# EAGLE design irs-v8 (EAGLE 7.6.0)
CNAME: IRS sensor (RFM69HW); CREVISION: 1; DESIGNER: Dariusz Mazur
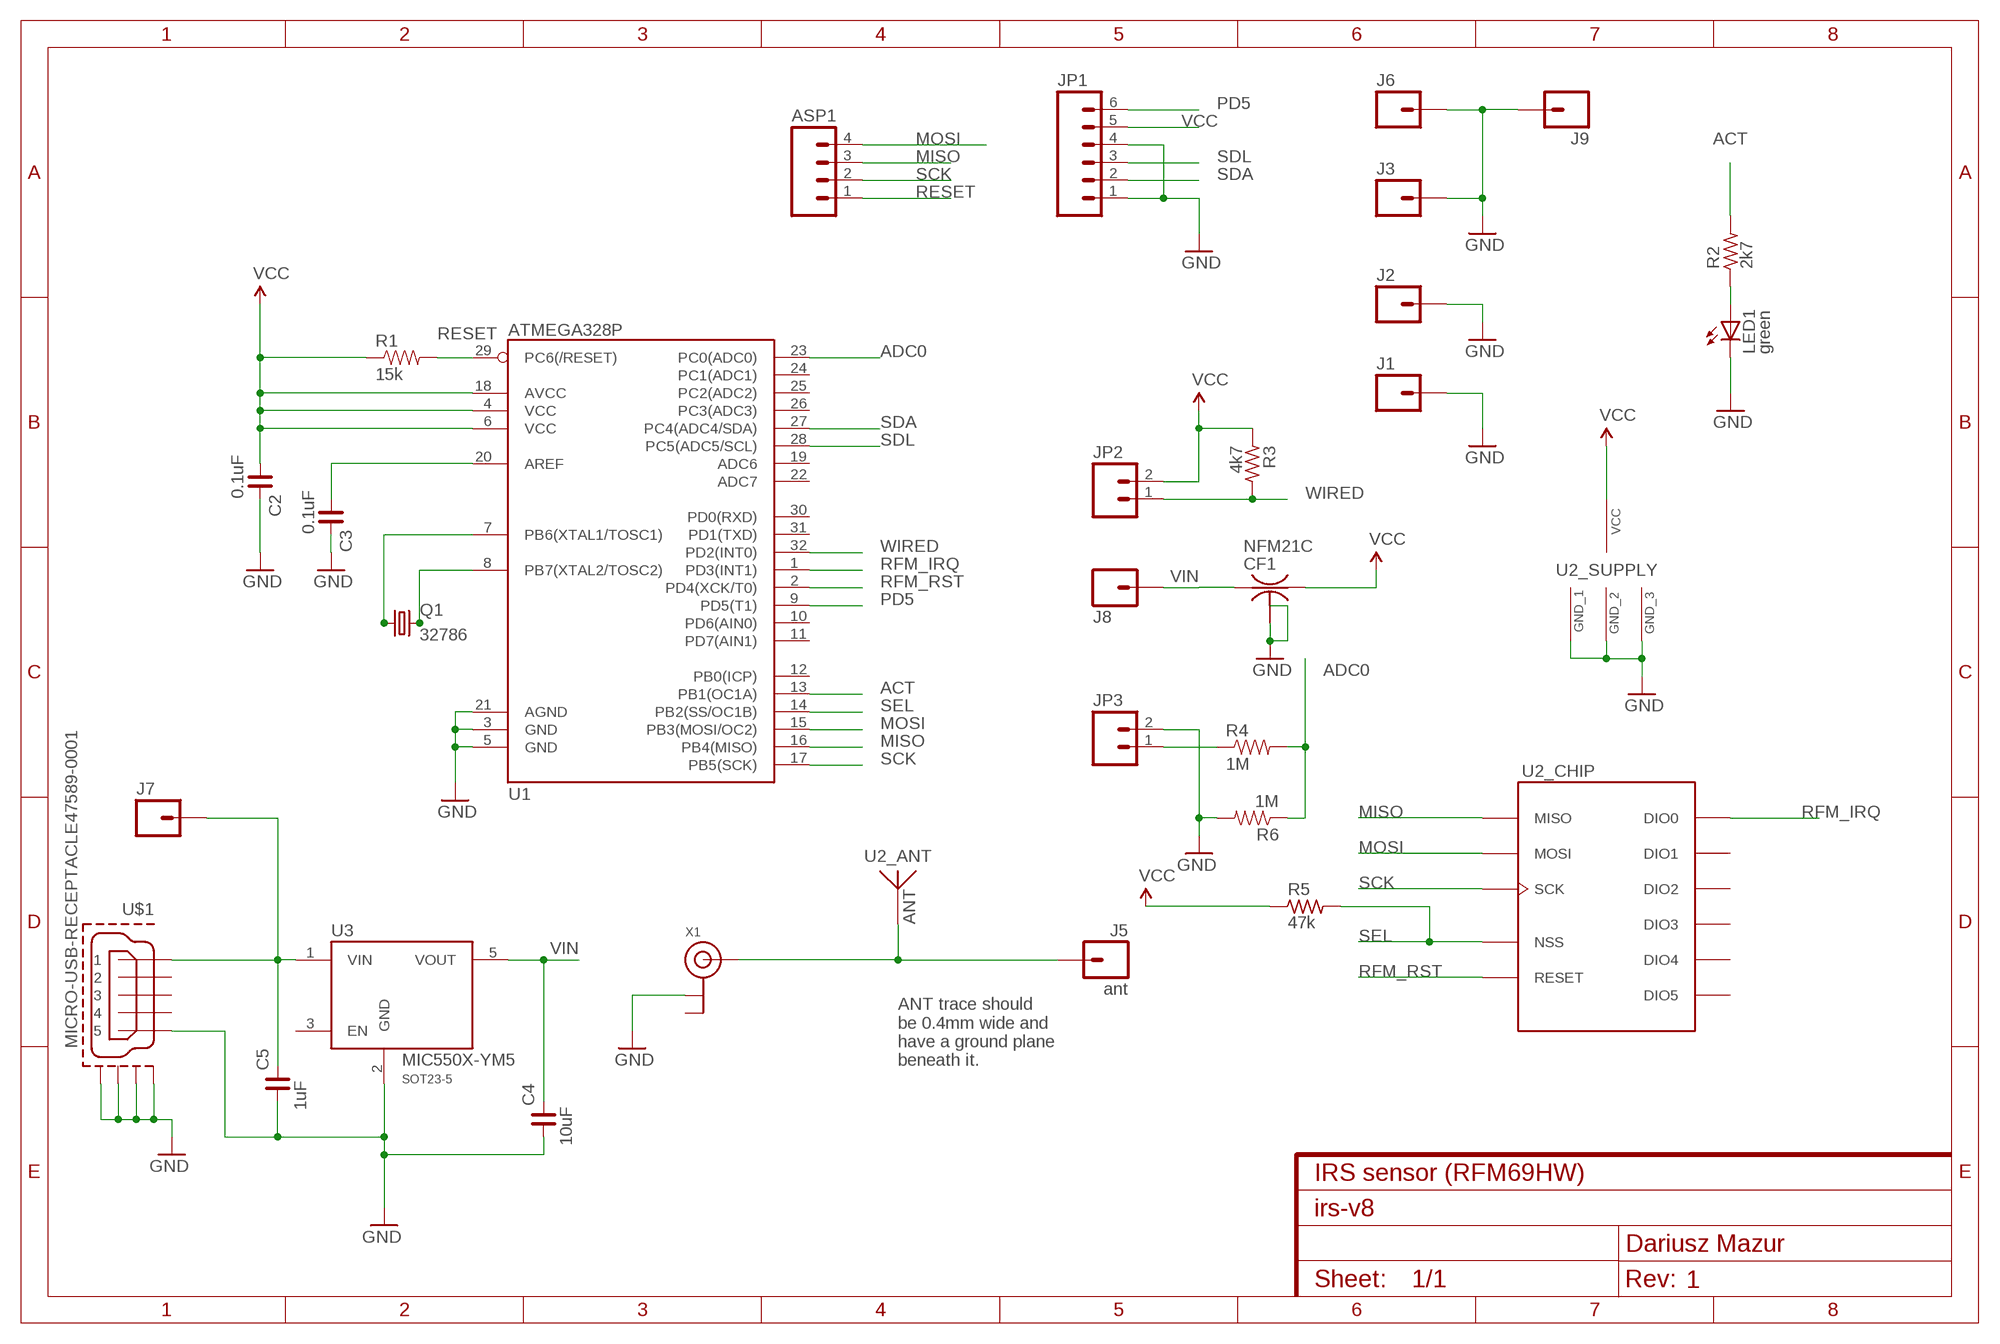
[diagram p0: schematic, sheet 1]

## Parts
ASP1  M04NO_SILK_ALL_ROUND  [1X04_NO_SILK_ALL_ROUND]
C2  0.1uF  C_0603  [C0603]
C3  0.1uF  C_0603  [C0603]
C4  10uF  C_0805  [C0805]
C5  1uF  C_0805  [C0805]
CF1  NFM21C  [NFM21C]
J1  M01PTH_NO_SILK_YES_STOP  [1X01_NO_SILK]
J2  M01PTH_NO_SILK_YES_STOP  [1X01_NO_SILK]
J3  M01PTH_NO_SILK_YES_STOP  [1X01_NO_SILK]
J5  ant  M01PTH_NO_SILK_YES_STOP  [1X01_NO_SILK]
J6  M01PTH_NO_SILK_YES_STOP  [1X01_NO_SILK]
J7  M01PTH_NO_SILK_YES_STOP  [1X01_NO_SILK]
J8  M01PTH_NO_SILK_YES_STOP  [1X01_NO_SILK]
J9  M01PTH_NO_SILK_YES_STOP  [1X01_NO_SILK]
JP1  M06NO_SILK_FEMALE_PTH  [1X06_NO_SILK]
JP2  M021X02_NO_SILK  [1X02_NO_SILK]
JP3  M021X02_NO_SILK  [1X02_NO_SILK]
LED1  green  LED0603  [LED-0603]
Q1  32786  MC-306  [MC-306]
R1  15k  RESISTOR0603-RES  [0603-RES]
R2  2k7  R_0603  [R0603]
R3  4k7  R_0603  [R0603]
R4  1M  RESISTOR0603-RES  [0603-RES]
R5  47k  R_0603  [R0603]
R6  1M  RESISTOR0603-RES  [0603-RES]
U1  ATMEGA328P  ATMEGA328_SMT  [TQFP32-08]
U2  RFM69HCW-S2  [HOPE-RF-16]
U3  MIC550X-YM5  [SOT23-5-DBV]
U$1  MICRO-USB-RECEPTACLE47589-0001  [47589-0001]
X1  ANTENNA_U.FL  [U.FL]

## Nets
ACT: R2.2 U1.13(PB1(OC1A))
ADC0: R4.2 R6.1 U1.23(PC0(ADC0))
GND: C2.2 C3.2 C4.1 C5.1 CF1.2@1 CF1.2@2 J1.1 J2.1 J3.1 J6.1 J9.1 JP1.1 JP1.4 JP3.2 LED1.C R6.2 U1.3(GND) U1.5(GND) U1.21(AGND) U2.GND1(_SUPPLY:GND_1) U2.GND2(_SUPPLY:GND_2) U2.GND3(_SUPPLY:GND_3) U3.2(GND) U$1.5 U$1.CASING1(GND1) U$1.CASING2(GND2) U$1.CASING3(GND3) U$1.CASING4(GND4) X1.1(GND)
MISO: ASP1.3 U1.16(PB4(MISO)) U2.MISO(_CHIP:MISO)
MOSI: ASP1.4 U1.15(PB3(MOSI/OC2)) U2.MOSI(_CHIP:MOSI)
N$1: LED1.A R2.1
N$2: JP3.1 R4.1
N$3: J5.1 U2.ANT(_ANT:ANT) X1.3(SIGNAL)
N$4: C3.1 U1.20(AREF)
N$5: Q1.1 U1.7(PB6(XTAL1/TOSC1))
N$6: Q1.4 U1.8(PB7(XTAL2/TOSC2))
N$13: C5.2 J7.1 U3.1(VIN) U$1.1
PD5: JP1.6 U1.9(PD5(T1))
RESET: ASP1.1 R1.2 U1.29(PC6(/RESET))
RFM_IRQ: U1.1(PD3(INT1)) U2.DIO0(_CHIP:DIO0)
RFM_RST: U1.2(PD4(XCK/T0)) U2.RESET(_CHIP:RESET)
SCK: ASP1.2 U1.17(PB5(SCK)) U2.SCK(_CHIP:SCK)
SDA: JP1.2 U1.27(PC4(ADC4/SDA))
SDL: JP1.3 U1.28(PC5(ADC5/SCL))
SEL: R5.2 U1.14(PB2(SS/OC1B)) U2.NSS(_CHIP:NSS)
VCC: C2.1 CF1.3 JP1.5 JP2.2 R1.1 R3.1 R5.1 U1.4(VCC) U1.6(VCC) U1.18(AVCC) U2.3.3V(_SUPPLY:VCC)
VIN: C4.2 CF1.1 J8.1 U3.5(VOUT)
WIRED: JP2.1 R3.2 U1.32(PD2(INT0))
Unconnected: U1.10(PD6(AIN0)) U1.11(PD7(AIN1)) U1.12(PB0(ICP)) U1.19(ADC6) U1.22(ADC7) U1.24(PC1(ADC1)) U1.25(PC2(ADC2)) U1.26(PC3(ADC3)) U1.30(PD0(RXD)) U1.31(PD1(TXD)) U2.DIO1(_CHIP:DIO1) U2.DIO2(_CHIP:DIO2) U2.DIO3(_CHIP:DIO3) U2.DIO4(_CHIP:DIO4) U2.DIO5(_CHIP:DIO5) U3.3(EN) U$1.2 U$1.3 U$1.4 X1.2(GND)

## Notes on the sheet
- ANT trace should
  be 0.4mm wide and
  have a ground plane
  beneath it.

## Library data of the parts
ASP1 = SparkFun-Connectors:M04: Header 4 Standard 4-pin 0.1" header. Use with straight break away headers (SKU : PRT-00116), right angle break away headers (PRT-00553), swiss pins (PRT-00743), machine pins (PRT-00117), and female headers (PRT-00115). Molex polarized connector foot print use with SKU : PRT-08231 with associated crimp pins and housings. 1MM SMD Version SKU: PRT-10208; PROD_ID: CONN-09696
C2-C5 = rc-master-smd:C_: NON-POLARIZED CAP
CF1 = murata-filter:NFM: EMIFIL(R) (Capacitor type) Single Circuit Type for Signal Lines Source: http://search.murata.co.jp/Ceramy/image/img/PDF/ENG/L0111S0109NFM3DC.pdf; MPN: NFM21CC102R1H3D; OC_FARNELL: 1828795; OC_NEWARK: 84R0165
J1-J3 J5-J9 = SparkFun-Connectors:M01: Header 1 Standard 1-pin 0.1" header. Use with straight break away headers (SKU : PRT-00116), right angle break away headers (PRT-00553), swiss pins (PRT-00743), machine pins (PRT-00117), and female headers (PRT-00115). SMTSO-256-ET is a "flush mount" nut for a 4-40 screw. The older package used to be too tight, and did not allow it to sit properly thru the drill hit. The latest (0.165DIA) fits nice and snug.
JP1 = SparkFun-Connectors:M06: Header 6 Standard 6-pin 0.1" header. Use with straight break away headers (SKU : PRT-00116), right angle break away headers (PRT-00553), swiss pins (PRT-00743), machine pins (PRT-00117), and female headers (PRT-00115). Molex polarized connector foot print use with SKU : PRT-08094 with associated crimp pins and housings. NOTES ON THE VARIANTS LOCK and LOCK_LONGPADS... This footprint was designed to help hold the alignment of a through-hole component (i.e. 6-pin header) while soldering it into place. You may notice that each hole has been shifted either up or down by 0.005 of an inch from it's more standard position (which is a perfectly straight line). This slight alteration caused the pins (the squares in the middle) to touch the edges of the holes. Because they are alternating, it causes a "brace" to hold the component in place. 0.005 has proven to be the perfect amount of "off-center" position when using our standard breakaway headers. Although looks a little odd when you look at the bare footprint, once you have a header in there, the alteration is very hard to notice. Also,if you push a header all the way into place, it is covered up entirely on the bottom side. This idea of altering the position of holes to aid alignment will be further integrated into the Sparkfun Library for other footprints. It can help hold any component with 3 or more connection pins.; PROD_ID: CONN-08437
JP2 JP3 = SparkFun-Connectors:M02: Standard 2-pin 0.1" header. Use with - straight break away headers ( PRT-00116) - right angle break away headers (PRT-00553) - swiss pins (PRT-00743) - machine pins (PRT-00117) - female headers (PRT-00115) Molex polarized connector foot print use with: PRT-08233 with associated crimp pins and housings. 2.54_SCREWTERM for use with PRT-10571. 3.5mm Screw Terminal footprints for PRT-08084 5mm Screw Terminal footprints for use with PRT-08432
LED1 = SparkFun-LED:LED: LEDs Standard schematic elements and footprints for 5mm, 3mm, 1206, and 0603 sized LEDs. 5mm - Spark Fun Electronics SKU : COM-00529 (and others)
Q1 = crystal:MC-306: kHz RANGE CRYSTAL UNIT SMD Source: MC-306_405_406_E07X.PDF Homepage <http://www.epsontoyocom.co.jp>; MPN: MC-306 60.0KHZ 100PPM ,12.5PF; OC_FARNELL: 1278040; OC_NEWARK: 31M5576
R1 R4 R6 = SparkFun-Passives:RESISTOR: Resistor Basic schematic elements and footprints for 0603, 1206, and PTH resistors.
R2 R3 R5 = rc-master-smd:R_: RESISTOR
U1 = SparkFun-DigitalIC:ATMEGA328_SMT: 32-Pin Atmega328 part Commonly used on Arduino compatible boards Available in QFP and QFN packages TQFP is IC-09069 QFN is non-stock; PROD_ID: IC-09069
U2 = icmi-custom-parts:RFM69HCW: HopeRF RFM69HCW ISM Transceiver Module The RFM69HCW <http://www.hoperf.com/rf/fsk_module/RFM69HCW.htm> is a transceiver module capable of operation over a wide frequency range, including the 315,433,868 and 915MHz license-free ISM (Industry Scientific and Medical) frequency bands. All major RF communication parameters are programmable and most of them can be dynamically set. The RFM69HCW offers the unique advantage of programmable narrow-band and wide- band communication modes. The RFM69HCW is optimized for low power consumption while offering high RF output power and channelized operation. Compliance ETSI and FCC regulations. In order to better use RFM69HCW modules, this specification also involves a large number of the parameters and functions of its core chip RF69H's,including those IC pins which are not leaded out. All of these can help customers gain a better understanding of the performance of RFM69HCW modules, and enhance the application skills.
U3 = borkedlabs-powerics:MIC550X; PACKAGE: SOT23-5
U$1 = con-molex-usb:MICRO-USB-RECEPTACLE: MICRO USB RECEPTACLES Micro-USB Receptacles, SMT, Lead-Free from MOLEX <http://www.molex.com/>. (C) 2014 Tomasz Boleslaw CEDRO, cederom@tlen.pl, http://www.tomek.cedro.info. Version 0.1 (2014-01-17): Initial release. Version 0.2 (2014-02-06): Updated 47589-0001 footprint pins/pads/milling. Following devices are included: 1. 47589-0001 Micro-USB AB Receptacle, Bottom Mount, SMT, Lead-Free <http://www.molex.com/molex/products/datasheet.jsp?part=active/0475890001_IO_CONNECTORS.xml> (Technical Drawing <http://www.molex.com/pdm_docs/sd/475890001_sd.pdf>).
X1 = adafruit:ANTENNA_U.FL: U.FL Antenna Connector

## Board
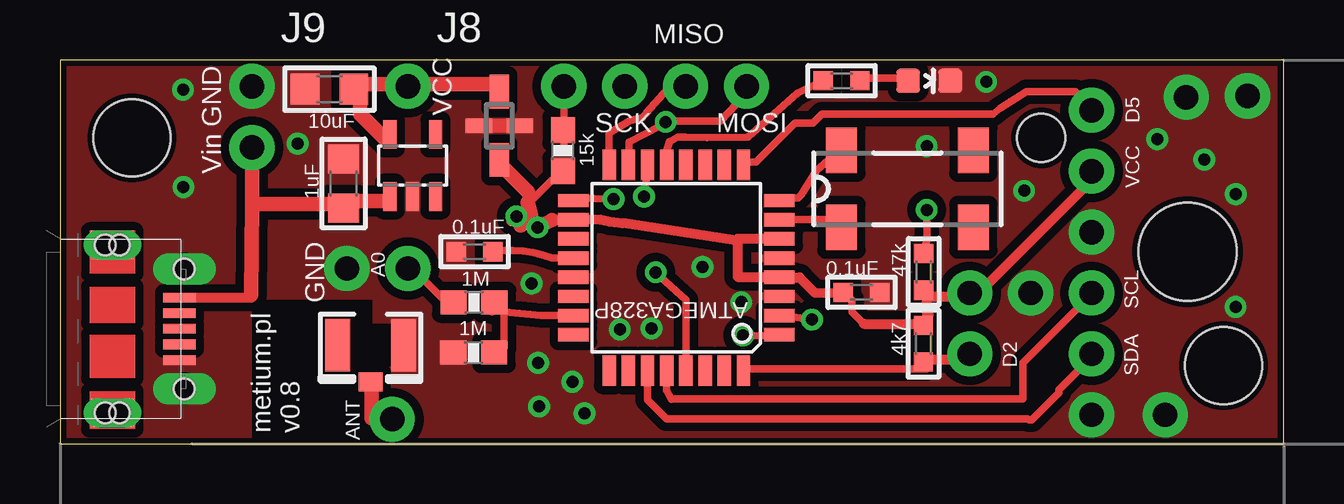
[diagram p1: board, top side]
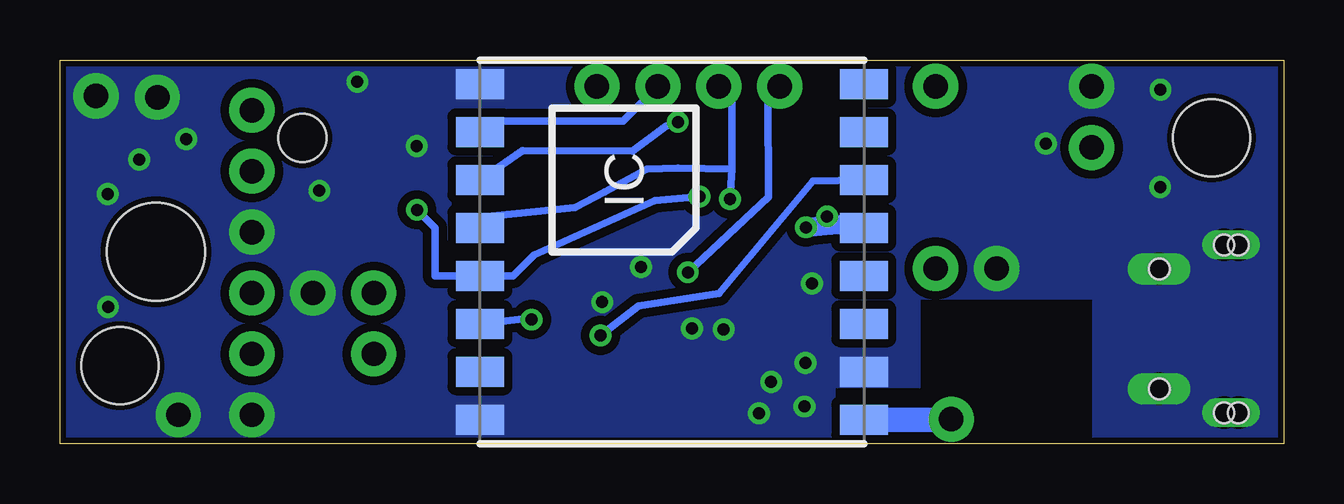
[diagram p2: board, bottom side, seen from below]

Size 51 x 16 mm. Coordinates in mm from the lower left corner, seen from the top.
Outline: 0,0 51,0 51,16 0,16 0,0
Copper layers (1*16): Top 0.035mm / dielectric 1.5mm / Bottom 0.035mm
Design rules "dirt_cheap_dirty_boards.v1 *": minimum track width 12mil, minimum drill 15mil, track to track 14mil, track to pad 14mil, pad to pad 12mil, via to via 12mil, smd to smd 0mil, copper to edge 10mil, drill to drill 12mil, minimum pad ring 12mil, minimum via ring 8mil, stop-mask expansion 2mil, vias tented up to drill 25mil, thermal gap 10mil
Holes 4.1 mm at 47,8
Holes 3.2 mm at 48.5,3.25 3,12.75
Holes 2 mm at 40.9,12.75
tRestrict: area 8,0 to 13,6
bRestrict: area 32.5,3.8 to 34.5,4.2; area 32.5,7.8 to 35,8.1; area 32.5,5.8 to 34.5,6.2; area 8,0 to 13,6; area 16.5,9.7 to 18.6,10.2; area 17.3,12.9 to 17.7,15; area 16.5,11.8 to 18.6,12.1; area 13,1.9 to 18.6,2.3; area 32.5,9.8 to 34.7,10.2; area 13,1.3 to 15.1,6

### Footprints (pad centres in the part's own frame; a part is rotated, then mirrored left to right if it is on the bottom)
1X04_NO_SILK_ALL_ROUND = drill 1.016 pad 1.88: 1 0,0; 2 2.54,0; 3 5.08,0; 4 7.62,0
C0603 = smd 0.8 x 0.8: 1 -0.762,0; 2 0.762,0
C0805 = smd 1.2 x 1.3: 1 -1.016,0; 2 1.016,0
NFM21C = smd 1.4 x 0.8: 1 -1.425,0; 3 1.425,0 | smd 0.6 x 1.1: 2@1 0,-0.85; 2@2 0,0.85
1X01_NO_SILK = drill 1.016 pad 1.88: 1 0,0
1X06_NO_SILK = drill 1.016 pad 1.88: 1 0,0; 2 2.54,0; 3 5.08,0; 4 7.62,0; 5 10.16,0; 6 12.7,0
1X02_NO_SILK = drill 1.016 pad 1.88: 1 0,0; 2 2.54,0
LED-0603 = smd 1 x 1: A 0,-0.877; C 0,0.877
MC-306 = smd 1.3 x 1.9: 1 -2.75,-1.6; 2 2.75,-1.6; 3 2.75,1.6; 4 -2.75,1.6
0603-RES = smd 1.1 x 1: 1 -0.85,0; 2 0.85,0
R0603 = smd 0.8 x 0.8: 1 -0.762,0; 2 0.762,0
TQFP32-08 = smd 1.27 x 0.559: 1 -4.293,2.8; 2 -4.293,2; 3 -4.293,1.2; 4 -4.293,0.4; 5 -4.293,-0.4; 6 -4.293,-1.2; 7 -4.293,-2; 8 -4.293,-2.8; 17 4.293,-2.8; 18 4.293,-2; 19 4.293,-1.2; 20 4.293,-0.4; 21 4.293,0.4; 22 4.293,1.2; 23 4.293,2; 24 4.293,2.8 | smd 0.559 x 1.27: 9 -2.8,-4.293; 10 -2,-4.293; 11 -1.2,-4.293; 12 -0.4,-4.293; 13 0.4,-4.293; 14 1.2,-4.293; 15 2,-4.293; 16 2.8,-4.293; 25 2.8,4.293; 26 2,4.293; 27 1.2,4.293; 28 0.4,4.293; 29 -0.4,4.293; 30 -1.2,4.293; 31 -2,4.293; 32 -2.8,4.293
HOPE-RF-16 = smd 1.25 x 2: 3.3V 1,-8; ANT -7,-8; DIO0 3,-8; DIO1 5,-8; DIO2 7,-8; DIO3 -3,-8; DIO4 -1,-8; DIO5 -5,8; GND1 7,8; GND2 -7,8; GND3 -5,-8; MISO 5,8; MOSI 3,8; NSS -1,8; RESET -3,8; SCK 1,8
SOT23-5-DBV = smd 0.55 x 1.2: 1 -0.95,-1.3; 2 0,-1.3; 3 0.95,-1.3; 4 0.95,1.3; 5 -0.95,1.3
47589-0001 = smd 1.35 x 0.4: 1 2.8,1.3; 2 2.8,0.65; 3 2.8,0; 4 2.8,-0.65; 5 2.8,-1.3 | drill 0.6 pad 0.95 long: CASING1 0,3.5; CASING2 0,-3.5 | drill 0.7 pad 1.1 long: CASING3 3,2.5; CASING4 3,-2.5 | smd 1.8 x 1.2: P$1 0,3.5; P$2 0,-3.5 | hole 0.85: 3,2.5; 3,-2.5; -0.3,3.5; -0.3,-3.5; 0.3,3.5; 0.3,-3.5
U.FL = smd 2.2 x 1.05: 1 0,1.375; 2 0,-1.375 | smd 0.8 x 1: 3 1.525,0

### Placement (x,y rotation side)
ASP1  21,14.9 0 top
C2  33.41,6.31 0 top
C3  17.28,8 180 top
C4  11.24,14.78 0 top
C5  11.82,10.84 270 top
CF1  18.31,13.25 270 top
J1  46.07,1.2 0 top
J2  49.5,14.5 90 top
J3  46.94,14.44 0 top
J5  13.85,1.02 0 top
J6  40.46,6.28 0 top
J7  8,12.35 0 top
J8  14.5,14.9 0 top
J9  8,14.9 0 top
JP1  43,1.2 90 top
JP2  37.92,3.74 90 top
JP3  14.5,7.3 180 top
LED1  36.23,15.13 270 top
Q1  35.33,10.62 0 top
R1  20.96,12.22 90 top
R2  32.58,15.13 180 top
R3  35.99,4.17 270 top
R4  17.26,5.89 0 top
R5  36,7.16 90 top
R6  17.24,3.8 180 top
U1  25.69,7.34 180 top
U2  25.5,8 90 bottom
U3  14.7,11.6 0 top
U$1  2.18,4.78 0 top
X1  12.95,4.1 270 top

### Tracks (layer width: path | path; a pad name or v marks a point on that pad's centre or on a via)
ACT
  Top 0.305: R2.2 31.5,15 30.73,14.62 28.68,12.78 26.97,12.77 26.06,12.79 25.75,12.79 25.4,12.6 25.29,12.24 U1.13
ADC0
  Top 0.305: 21.25,5.35 U1.23 20.06,5.34 18.5,5.5 | 18,3.5 R6.1 18.5,4 18.5,5.5 | 18,5.5 R4.2 18.5,5.5
GND  (via drill 0.5 pad 0.25)
  Top 0.305: U1.21
  Top 0.61: CF1.2@2 CF1.2@1
  other vias: 24.66,4.8 19.92,3.37 19.66,6.68 21.36,2.58 19.97,1.54 49,5.7 49.01,10.4 40.19,10.54 45.74,12.69 47.7,11.84 36.13,12.41 28.4,5.9 5.15,10.7 23.34,4.76 21.86,1.26 9.91,12.51 5.13,14.76 26.78,7.36 38.61,15.09
  pour Bottom (rank 6, no thermals): 0,16 51,16 51,0 0,0
  pour Top (rank 6, no thermals): 0,16 51,16 51,0 0,0
MISO
  Top 0.305: U1.16 22.88,11.96 22.88,12.96 23.75,13.47 24.28,13.6 24.45,13.8 25.31,14.76 26,14.75 ASP1.3
  Bottom 0.305: U2.MISO 33.01,13.45 27.54,13.44 26.25,14.75 ASP1.3
MOSI  (via drill 0.5)
  Top 0.305: ASP1.4 28.5,14.5 27.52,13.45 25.27,13.45 v25.25,13.41 25,13.25 23.72,12.57 U1.15
  Bottom 0.305: U2.MOSI 31.72,12.22 27.14,12.19 25.75,13.25 v25.25,13.41
N$1
  Top 0.305: LED1.A 35.25,15.25 33.5,15.25 R2.1
N$2
  Top 0.305: R4.1 16,6 14.5,7.5 JP3.1
N$3
  Top 0.406: X1.3 12.99,2.69 | 12.99,1.06 13.85,1.09 J5.1
  Top 0.61: 12.99,2.69 12.99,1.06
  Bottom 0.61: 13.85,1 J5.1
  Bottom 1.016: U2.ANT 13.85,1
N$4
  Top 0.305: U1.20 20.52,7.74 arc27 C3.1
N$5
  Top 0.305: U1.7 32.34,9.34 Q1.1
N$6
  Top 0.305: U1.8 30,10.25 30.75,10.25 30.9,10.38 31.54,11.39 32.5,12.25 Q1.4
N$11
  Top 0.406: 19.2,9.09 18.82,9.28
  Top 0.61: 19.57,9.34 19.2,9.09
N$13
  Top 0.305: 11.88,10.12 11.88,9.88 C5.2 11.75,10 | 13.5,10.12 U3.1
  Top 0.406: U$1.1 7.97,6.08 7.97,6.21
  Top 0.61: 11.88,10.12 13.5,10.12 | 7.97,6.21 8,10 | 8,10 J7.1 | 8,10 11.75,10
PD5
  Top 0.305: 43,14 JP1.6 | U1.9 28.5,11.75 29,11.75 30.62,13.38 31.38,13.38 31.75,13.75 38.88,13.75 39.2,14 40.27,14.68 42.33,14.68 42.38,14.62 42.88,14.12 42.88,14 JP1.6 | 42.88,13.88 JP1.6
RESET  (via drill 0.5)
  Top 0.305: v24.83,7.14 26.1,5.99 26.1,3.54 U1.29 | ASP1.1 21,12.5 R1.2
  Bottom 0.305: v24.83,7.14 21.47,10.29 21.5,14.5 21,14.5 ASP1.1
RFM_IRQ  (via drill 0.5)
  Top 0.305: v28.46,4.51 29.5,4.5 U1.1
  Bottom 0.305: v28.46,4.51 26.88,5.74 23.52,6.25 19.61,10.95 U2.DIO0
RFM_RST  (via drill 0.5)
  Top 0.305: v31.34,5.17 30.08,5.34 U1.2
  Bottom 0.305: v31.34,5.17 31.69,5.2 U2.RESET
SCK  (via drill 0.5)
  Top 0.305: v23.07,10.2 21.5,10.25 U1.17
  Bottom 0.305: 22.98,11.45 22.98,14.7 23.5,14.75 ASP1.2 | 22.98,11.45 v23.07,10.2 | U2.SCK 33,9.5 29.53,9.85 28.31,10.5 26.53,11.44 25.25,11.5 22.98,11.45
SDA
  Top 0.305: U1.27 24.49,1.82 25.29,1.02 40.33,1.02 40.38,1 40.5,1 41.62,2.12 41.62,2.25 43,3.62 JP1.2
SDL
  Top 0.305: U1.28 25.28,2.97 25.28,2.22 25.48,1.85 25.62,1.88 40.12,1.88 40.12,3.38 43,6.25 JP1.3
SEL  (via drill 0.5)
  Top 0.305: v24.34,10.3 24.5,11.5 U1.14 | v36.12,9.75 36.12,8.5 R5.2
  Bottom 0.305: v36.12,9.75 35.38,9 35.38,7 U2.NSS 32.12,7 31.25,7.88 26.19,10.13 v24.34,10.3
VCC  (via drill 0.5 pad 0.61)
  Top 0.305: 28.24,8.53 28.24,8.5 28.25,8.5 | 29.75,6.95 U1.4 | 21.52,9.33 U1.18 | 36.25,5.38 R3.1 | 36.12,5.38 R3.1 | 32.55,6.29 C2.1 33,6 33,5.5 33.5,5 | 36,5 R3.1 | 36.12,6.12 36,6.25 R5.1 36.25,6.12 | 36.12,5.5 R3.1 | 38,6.12 JP2.2 38,6 | 43,11 JP1.5 | 19.62,9.5 v19.91,9.02 | 28.25,8.5 28.25,8.54 | 28.25,8.5 28.2,8.47 | 19.5,10 19.5,10.06 | 19.5,10 20.5,11 R1.1 | 19.5,10 19.5,10.5 | 18.5,11.5 CF1.3 | 19.5,10 19.51,10
  Top 0.406: 29.75,6.95 28.25,6.95 28.24,7.63 28.24,8.5 | 21.52,9.33 22.55,9.34 22.93,9.25 23.45,9.19 28.2,8.47 | 20.52,9.33 U1.18 | U1.6 28.25,8.54 | U1.4 30.83,6.93 31.47,6.29 32.55,6.29 | 33.5,5 36,5 | 36.12,5.5 36.12,6.12 | 38,6.12 36.25,6.12 | 38,6 43,11
  Top 0.61: 20.52,9.33 v19.91,9.02 | 19.62,9.5 19.51,10 19.5,10.06 | 19.5,10.5 18.5,11.5
  Bottom 0.305: 18.32,8.89 U2.3.3V | 18.42,9.14 U2.3.3V | 17.37,9.21 U2.3.3V | v19.02,9.48 18.93,9 18.86,9.11
  Bottom 0.813: 18.42,9.14 18.86,9.11 v19.91,9.02
VIN
  Top 0.305: 12.5,14.5 C4.2 | 18,15 CF1.1 | 12.5,15 C4.2 | 14.5,15 J8.1 | 13.5,12.75 U3.5 | 12.5,14.38 C4.2
  Top 0.61: 18,15 14.5,15 12.5,15 | 13.5,12.75 12.5,13.75 12.5,14.38
WIRED
  Top 0.305: 36.12,3.12 36,3.12 | 36,3.12 28.5,3.12 U1.32 | 36.12,3.5 R3.2 | R3.2 36,3.12 | JP2.1 38,3.5 | 36.25,3.5 R3.2
  Top 0.406: 38,3.5 36.25,3.5

### Text on the board
tPlace: MISO | GND | VCC | SCK | MOSI | Vin | D5 | VCC | GND | A0 | SCL | D2 | SDA | metium.pl / v0.8 | ANT
Document: RESET | VCC